# EAGLE design boardv2 (EAGLE 9.6.2)
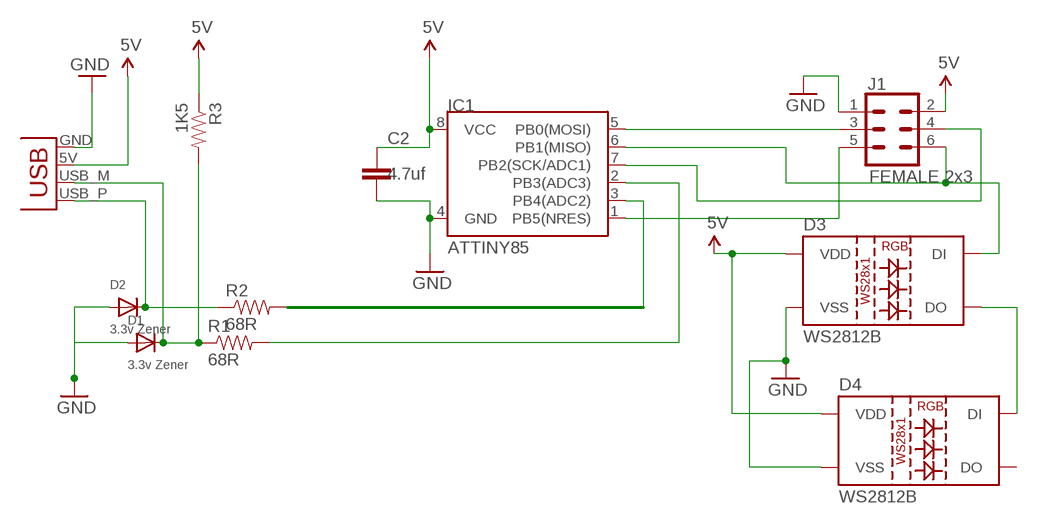
[diagram p0: schematic, sheet 1]

## Parts
C2  4.7uf  C-EUC1206  [C1206]
D1  3.3v Zener  DIODESOD-123  [SOD-123]
D2  3.3v Zener  DIODESOD-123  [SOD-123]
D3  WS2812B  [WS2812B]
D4  WS2812B  [WS2812B]
IC1  ATTINY85  ATTINY45  [SO08-EIAJ]
J1  FEMALE 2x3  CONN_03X2FEMALE  [2X3]
R1  68R  RESISTOR1206  [1206]
R2  68R  RESISTOR1206  [1206]
R3  1K5  RESISTOR1206  [1206]
X1  USBPCB  [USB-A-PCB]

## Nets
5V [Power]: C2.1 D3.1(VDD) D4.1(VDD) IC1.8(VCC) J1.2 R3.1 X1.5V(VBUS)
GND [Power]: C2.2 D1.A D2.A D3.3(VSS) D4.3(VSS) IC1.4(GND) J1.1 X1.GND
MISO: D3.4(DI) IC1.6(PB1(MISO)) J1.6
N$2: D3.2(DO) D4.4(DI)
RESET: IC1.1(PB5(NRES)) J1.5
SCK: IC1.7(PB2(SCK/ADC1)) J1.4
SDA/MOSI: IC1.5(PB0(MOSI)) J1.3
USB+: IC1.2(PB3(ADC3)) R1.2
USB-: IC1.3(PB4(ADC2)) R2.2
USB-M: D1.C R1.1 R3.2 X1.USB_M(D-)
USB-P: D2.C R2.1 X1.USB_P(D+)
Unconnected: D4.2(DO)

## Library data of the parts
C2 = rcl:C-EU: CAPACITOR, European symbol; SPICEPREFIX: C
D1 D2 = adafruit:DIODE: Diode SMADIODE - SMA Surface Mount Package 20V 1A Schottky Diode Digikey: 641-1014-6-ND DO-1N4148 - Through Hole Small Current Diode SOD-123 20V 1 A (.5mV Vf) Schottky Diode - Digikey: MBRX120TPMSCT-ND SOD-323 10V 570mA (.38mV Vf, 3ns) Schottky Diode - Digikey: ZLLS410CT-ND SOD-523 30V 30mA Schottky Diode (RB751S-40TE61) - Digikey: RB751S-40TE61CT-ND SOT23-R/W - SOT23 Package (R = Solder Paste/Reflow Ovens, W = Hand-Soldering) BAT54Film 40V 300mA - Digikey: 497-7162-1-ND
D3 D4 = SparkFun-LED:WS2812B: WS2812B SMD addressable RGB LED 5x5mm SMD LED with built-in controller IC. Color: Red/Green/Blue mC Rating: RGB: 390, 660, 180 mcd Forward Voltage: RGB: 2.0, 3.0, 3.0 V Packages:WS2812B SparkFun Products: Blynk Board - ESP8266 <https://www.sparkfun.com/products/13794>; PROD_ID: DIO-12503
IC1 = SparkFun:ATTINY45: Atmel ATTiny45
J1 = SparkFun-Connectors:CONN_03X2: Multi connection point. Often used as Generic Header-pin footprint for 0.1 inch spaced/style header connections You can populate with any combo of single row headers, but if you'd like an exact match, check these: Header - 2x3 (Male, 0.1") <https://www.sparkfun.com/products/12807> (PRT-12807) Header - 2x3 (Female, 0.1") <https://www.sparkfun.com/products/13010> (PRT-13010) 2x3 Pin Shrouded Header <https://www.sparkfun.com/products/10877> (PRT-10877) On any of the 0.1 inch spaced packages, you can populate with these: Break Away Headers - Straight <https://www.sparkfun.com/products/116> (PRT-00116) Break Away Male Headers - Right Angle <https://www.sparkfun.com/products/553> (PRT-00553) Female Headers <https://www.sparkfun.com/products/115> (PRT-00115) Break Away Headers - Machine Pin <https://www.sparkfun.com/products/117> (PRT-00117) Break Away Female Headers - Swiss Machine Pin <https://www.sparkfun.com/products/743> (PRT-00743) Special note: the shrouded connector mates well with our 3x2 ribbon cables: Ribbon Crimp Connector - 6-pin (2x3, Female) <https://www.sparkfun.com/products/10651> (PRT-10651) Ribbon Cable - 6 wire (15ft) <https://www.sparkfun.com/products/10646> (PRT-10646); PROD_ID: CONN-11566
R1-R3 = SparkFun:RESISTOR: Resistor Basic schematic elements and footprints for 0603, 1206, and PTH resistors.
X1 = SparkFun:USB: USB Connectors USB-B-PTH is fully proven SKU : PRT-00139 USB-miniB is fully proven SKU : PRT-00587 USB-A-PCB is untested. USB-A-H is throughly reviewed, but untested. Spark Fun Electronics SKU : PRT-00437 USB-B-SMT is throughly reviewed, but untested. Needs silkscreen touching up. USB-A-S has not been used/tested USB-MB-H has not been used/tested

## Net classes
0 default: width 0.508 mm
1 Power: width 0.711 mm

## Board
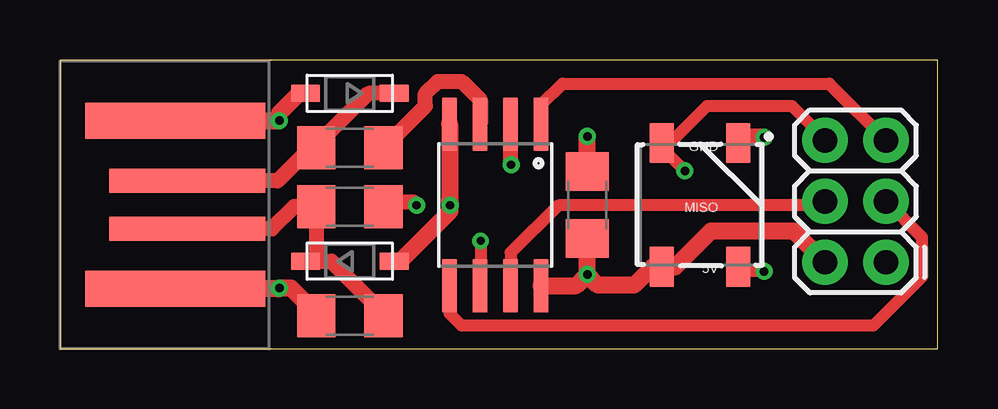
[diagram p1: board, top side]
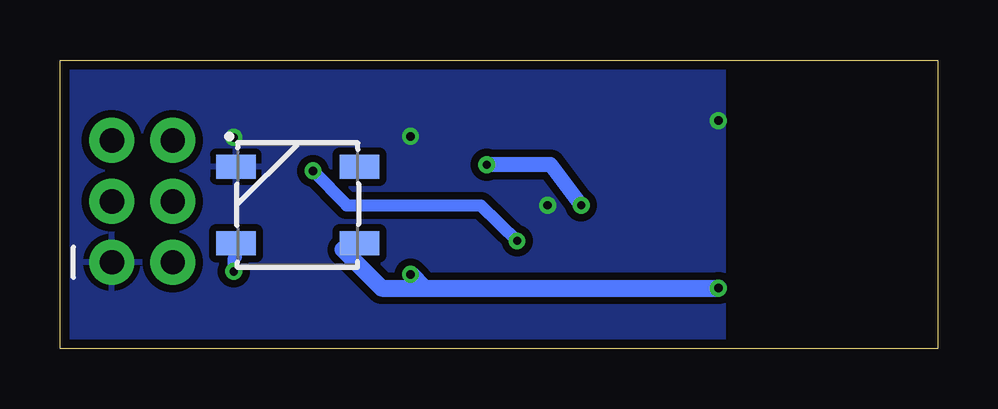
[diagram p2: board, bottom side, seen from below]

Size 36.58 x 12.04 mm. Coordinates in mm from the lower left corner, seen from the top.
Outline: 0,0 36.58,0.01 36.58,12.04 0,12.03 0,0
Copper layers (1*16): Top 0.0356mm / dielectric 1.5011mm / Bottom 0.0356mm
Design rules "default *": minimum track width 12mil, minimum drill 13mil, track to track 12mil, track to pad 12mil, pad to pad 12mil, via to via 12mil, smd to smd 8mil, copper to edge 15mil, drill to drill 12mil, minimum pad ring 7mil, minimum via ring 7mil, stop-mask expansion 4mil, vias tented up to drill 25mil, thermal gap 10mil

### Footprints (pad centres in the part's own frame; a part is rotated, then mirrored left to right if it is on the bottom)
C1206 = smd 1.6 x 1.8: 1 -1.4,0; 2 1.4,0
SOD-123 = smd 1.2 x 0.7: A 1.85,0; C -1.85,0
WS2812B = smd 1.651 x 1: 1 2.577,-1.6; 2 2.577,1.6; 3 -2.577,1.6; 4 -2.577,-1.6
SO08-EIAJ = smd 0.61 x 2.21: 1 -1.905,-3.378; 2 -0.635,-3.378; 3 0.635,-3.378; 4 1.905,-3.378; 5 1.905,3.353; 6 0.635,3.353; 7 -0.635,3.353; 8 -1.905,3.353
2X3 = drill 1.016 pad 1.88: 1 0,0; 2 0,2.54; 3 2.54,0; 4 2.54,2.54; 5 5.08,0; 6 5.08,2.54
1206 = smd 1.6 x 1.8: 1 -1.4,0; 2 1.4,0
USB-A-PCB = smd 7.5 x 1.5: 5V -0.2,-3.5; GND -0.2,3.5 | smd 6.5 x 1: USB_M 0.3,-1; USB_P 0.3,1

### Placement (x,y rotation side)
C2  21.97,6 90 top
D1  12.08,3.66 0 top
D2  12.08,10.65 180 top
D3  26.67,6 270 top
D4  26.67,6 0 bottom
IC1  18.14,5.99 180 top
J1  34.42,3.61 90 top
R1  12.08,5.93 0 top
R2  12.08,8.38 0 top
R3  12.08,1.39 0 top
X1  5,6 0 top

### Tracks (layer width: path | path; a pad name or v marks a point on that pad's centre or on a via)
5V  (via drill 0.35)
  Top 0.711: R3.1 10.68,1.49 9.63,2.53 v9.14,2.53 9.11,2.5 X1.5V | IC1.8 21.5,2.63 v21.97,3.1 | v21.97,3.1 22.41,2.66 23.93,2.66 24.69,3.42 D3.1 25.63,3.42 27.12,4.91 30.58,4.91 J1.2 | v21.97,3.1 C2.1
  Bottom 0.711: v21.97,3.1 21.4,2.53 v9.14,2.53 23.17,2.53 24.78,4.14 D4.1
GND  (via drill 0.35)
  Top 0.711: X1.GND 9.13,9.5 v9.14,9.52 9.14,9.82 9.97,10.65 D2.A | D3.3 28.51,8.82 v29.34,8.82 | C2.2 v21.97,8.86 | IC1.4 16.23,6.18 v16.26,5.99 16.26,5.74 14.18,3.66 D1.A
  pour Bottom: 8.89,11.87 40.39,11.87 40.39,0.18 8.89,0.18
MISO  (via drill 0.33, 0.35)
  Top 0.508: IC1.6 17.53,2.63 v17.53,4.5 | J1.6 31.88,8.74 30.5,10.11 26.95,10.11 25.53,8.69 25.15,8.69 25.07,8.62 D3.4 25.07,8.39 v26.04,7.42
  Bottom 0.508: v26.04,7.42 24.63,5.99 19.04,5.99 v17.53,4.5
N$2  (via drill 0.35)
  Top 0.508: v29.34,3.23 28.46,3.23 D3.2
  Bottom 0.508: v29.34,3.23 29.34,3.74 29.25,3.83 D4.4
RESET
  Top 0.508: IC1.1 20.04,10.17 20.93,11.05 32.06,11.05 J1.5
SCK
  Top 0.508: J1.4 31.75,5.99 20.78,5.99 18.77,4.01 IC1.7
SDA/MOSI
  Top 0.508: J1.3 35.92,4.65 35.92,2.99 33.9,0.97 16.73,0.97 16.23,1.47 IC1.5
USB+  (via drill 0.35)
  Top 0.635: R1.2 13.69,6.14 13.76,6.11 14.73,6.11 v14.86,5.99 | v18.8,7.68 18.77,7.7 IC1.2
  Bottom 0.635: v14.86,5.99 16.13,7.68 v18.8,7.68
USB-
  Top 0.635: R2.2 15.23,10.12 15.23,10.65 15.73,11.15 16.73,11.15 17.5,10.38 IC1.3
USB-M
  Top 0.635: X1.USB_M 8.83,5 9.76,5.93 R1.1 10.68,3.86 10.47,3.66 D1.C 11.31,3.66 13.47,1.49 R3.2
USB-P
  Top 0.635: X1.USB_P 9.07,7 10.19,8.12 10.42,8.12 R2.1 10.68,8.48 12.85,10.65 D2.C

### Text on the board
_tsilk: GND | MISO | 5V